# Altium schematic sheet ESP8266V3.SchDoc
size A3; : 汪  先; Organization: Altium Limited; Address1: L3, 12a Rodborough Rd; Address2: Frenchs Forest; Address3: NSW; Address4: Australia 2086; Size: A 4
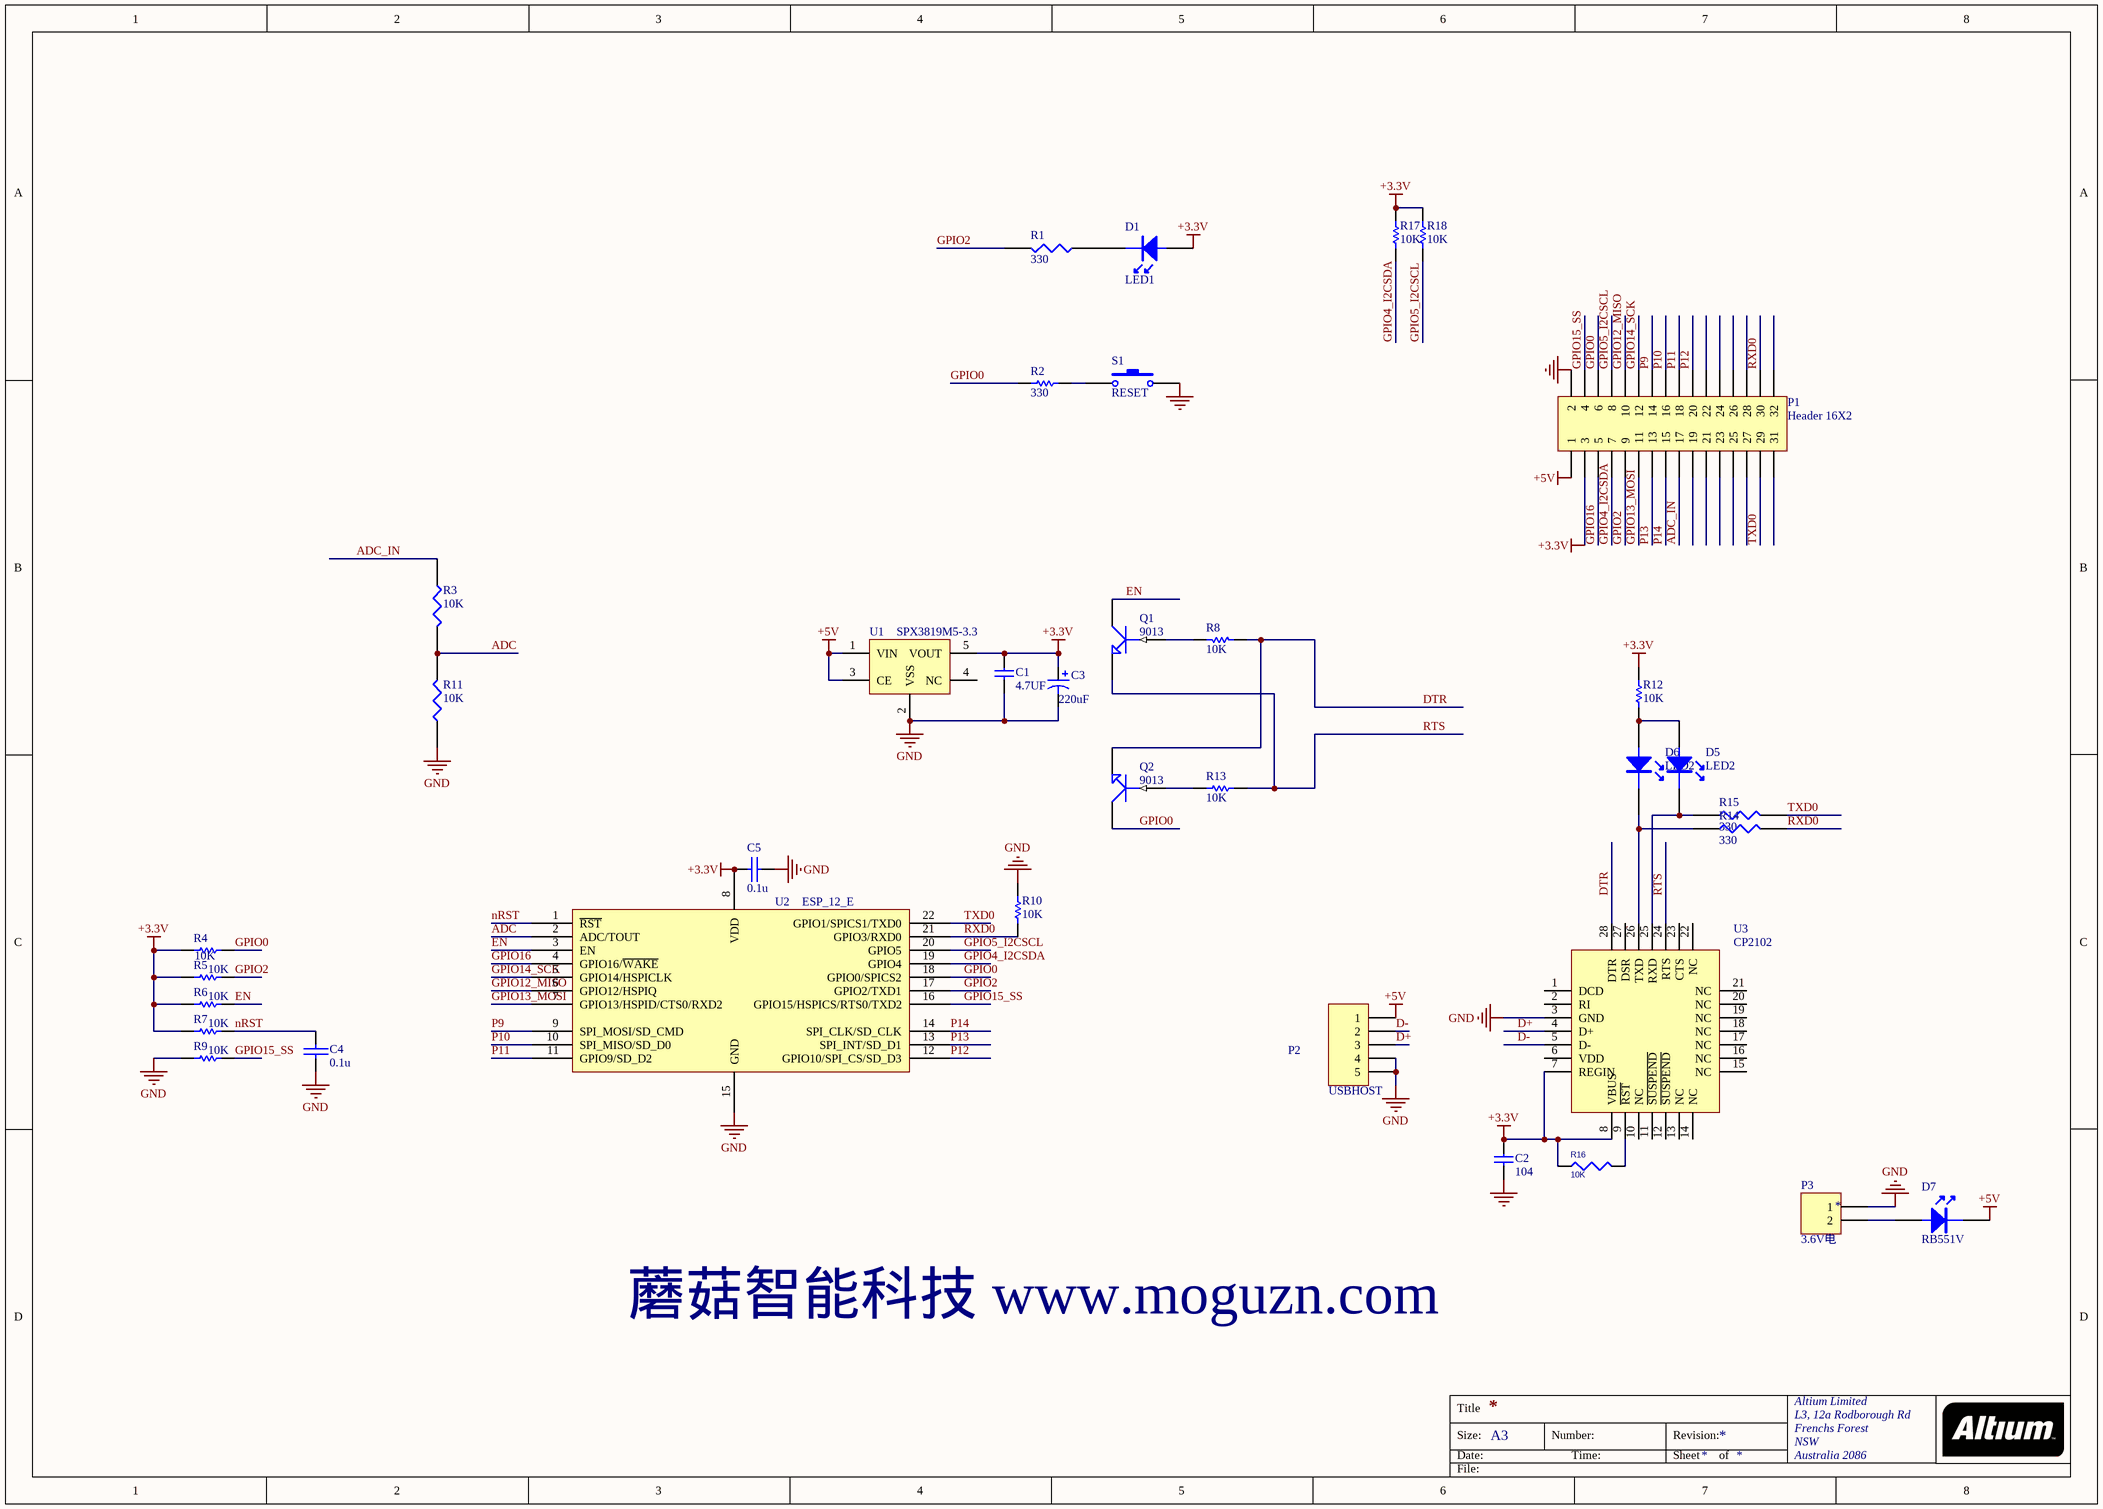
[diagram p0: ESP8266V3.SchDoc]

## Parts
C1  4.7UF  [0805C1]
C2  104  [0603CC]
C3  value 220uF  [CAP-6032]  (hidden comment: Cap Pol1)
C4  0.1u  [0603CC]
C5  0.1u  [0603CC]
D1  LED1  [0805LED]
D5  LED2  [0805LED]
D6  LED2  [0805LED]
D7  RB551V  [0805LED]
P1  Header 16X2  [HEADER 2*5]
P2  USBHOST  [USB_mini]
P3  *  [lithium_connector]
Q1  9013  [SOT-23]
Q2  9013  [SOT-23]
R1  330  [0603RR]
R2  value 330  [0603RR]  (hidden comment: Res1)
R3  10K  [0603RR]
R4  value 10K  [0603RR]  (hidden comment: Res1)
R5  value 10K  [0603RR]  (hidden comment: Res1)
R6  value 10K  [0603RR]  (hidden comment: Res1)
R7  value 10K  [0603RR]  (hidden comment: Res1)
R8  value 10K  [0603RR]  (hidden comment: Res Semi)
R9  value 10K  [0603RR]  (hidden comment: Res1)
R10  value 10K  [0603RR]  (hidden comment: Res1)
R11  10K  [0603RR]
R12  value 10K  [0603RR]  (hidden comment: Res Semi)
R13  value 10K  [0603RR]  (hidden comment: Res1)
R14  330  [0603RR]
R15  330  [0603RR]
R16  10K  [0603RR]
R17  value 10K  [0603RR]  (hidden comment: Res1)
R18  value 10K  [0603RR]  (hidden comment: Res Semi)
S1  RESET  [KEY_6*6*X _SMT]
U1  SPX3819M5-3.3  [SOT23-5]
U2  ESP_12_E  [ESP_12_E]
U3  CP2102  [QFN28]

## Nets
+3.3V: C1.1 C2.1 C3.1 C5.2 D1.1 P1.3 R4.2 R5.2 R6.2 R7.2 R12.1 R16.1 R17.2 R18.2 U1.5(VOUT) U2.8(VDD) U3.7(REGIN) U3.8(VBUS)
+5V: D7.2 P1.1 P2.1 U1.1(VIN) U1.3(CE)
GND: C1.2 C2.2 C3.2 C4.1 C5.1 P1.2 P2.4 P2.5 P3.1 R9.2 R10.1 R11.1 S1.1 U1.2(VSS) U2.15(GND) U3.3(GND)
ADC: R3.2 R11.2 U2.2(ADC/TOUT)
ADC_IN: P1.17 R3.1
D+: P2.3 U3.4(D+)
D-: P2.2 U3.5(D-)
DTR: Q2.2(E) R8.1 U3.28(DTR)
EN: Q1.3(C) R6.1 U2.3(EN)
GPIO0: P1.6 Q2.3(C) R2.1 R4.1 U2.18(GPIO0/SPICS2)
GPIO2: P1.9 R1.2 R5.1 U2.17(GPIO2/TXD1)
GPIO4_I2CSDA: P1.7 R17.1 U2.19(GPIO4)
GPIO5_I2CSCL: P1.8 R18.1 U2.20(GPIO5)
GPIO12_MISO: P1.10 U2.6(GPIO12/HSPIQ)
GPIO13_MOSI: P1.11 U2.7(GPIO13/HSPID/CTS0/RXD2)
GPIO14_SCK: P1.12 U2.5(GPIO14/HSPICLK)
GPIO15_SS: P1.4 R9.1 U2.16(GPIO15/HSPICS/RTS0/TXD2)
GPIO16: P1.5 U2.4(GPIO16/~{WAKE})
nRST: C4.2 R7.1 U2.1(~{RST})
P9: P1.14 U2.9(SPI_MOSI/SD_CMD)
P10: P1.16 U2.10(SPI_MISO/SD_D0)
P11: P1.18 U2.11(GPIO9/SD_D2)
P12: P1.20 U2.12(GPIO10/SPI_CS/SD_D3)
P13: P1.13 U2.13(SPI_INT/SD_D1)
P14: P1.15 U2.14(SPI_CLK/SD_CLK)
RTS: Q1.2(E) R13.1 U3.24(RTS)
RXD0: P1.30 R10.2 R14.2 U2.21(GPIO3/RXD0)
TXD0: P1.29 R15.2 U2.22(GPIO1/SPICS1/TXD0)
NetD1_2: D1.2 R1.1
NetD5_1: D5.1 D6.1 R12.2
NetD5_2: D5.2 R15.1 U3.25(RXD)
NetD6_2: D6.2 R14.1 U3.26(TXD)
NetD7_1: D7.1 P3.2
NetQ1_1: Q1.1(B) R8.2
NetQ2_1: Q2.1(B) R13.2
NetR2_2: R2.2 S1.2
NetR16_2: R16.2 U3.9(~{RST})

Not connected (* = marked no-connect by the designer): P1 19 21 22 23 24 25 26 27 28 31 32; U1 4(NC); U3 1(DCD) 2(RI) 6(VDD) 10(NC) 11(~{SUSPEND}) 12(~{SUSPEND}) 13(NC) 14(NC) 15(NC) 16(NC) 17(NC) 18(NC) 19(NC) 20(NC) 21(NC) 22(NC) 23(CTS) 27(DSR)

## Notes on the sheet
- 蘑菇智能科技 www.moguzn.com
- Title
- Size:
- Date:
- A3
- Number:
- Time:
- Revision:
- Sheet
- of
- File:
- (in symbol Header 2) 3.6V电

## Library data of the parts
C1 C2 = C0402-1.2p: Capacitor, NP0, ?.1pF; Value: 1.2pF; Note: 50V; Artikkelnr Noca: 20029157; Part Number: C0402-1.2p; Manufacturer: *; Manufacturer Part Number: *; Datasheet: *; Footprint: 0402; LatestRevisionDate: 2011-05-11; Pin Count: 2; Publisher: Nordic Semiconductor; Published: 2009-05-08; Supplier: *; Supplier part number: *; 2nd source Supplier: *; 2nd source part number: *
C3 = Cap Pol1: Polarized Capacitor (Radial); Published: 8-Jun-2000; LatestRevisionDate: 17-Jul-2002; LatestRevisionNote: Re-released for DXP Platform.; PackageReference: RB7.6-15; Publisher: Altium Limited; PackageDescription: Polarized Capacitor (Radial); 2 Leads
C4 C5 = CAP: Capacitor
D1 D5-D7 = LED
P1 = Header 16X2: Header, 16-Pin, Dual row; LatestRevisionDate: 17-Jul-2002; LatestRevisionNote: Re-released for DXP Platform.; Publisher: Altium Limited
P2 = Header 5: Header, 5-Pin; LatestRevisionDate: 17-Jul-2002; LatestRevisionNote: Re-released for DXP Platform.; Publisher: Altium Limited
P3 = Header 2: Header, 2-Pin; LatestRevisionDate: 17-Jul-2002; LatestRevisionNote: Re-released for DXP Platform.; Publisher: Altium Limited
Q1 Q2 = NPN1: NPN Transistor
R1 R3 R11 R14 R15 = RES1
R2 R4-R7 R9 R10 R13 R17 = Res1: Resistor; Published: 8-Jun-2000; LatestRevisionDate: 17-Jul-2002; LatestRevisionNote: Re-released for DXP Platform.; PackageReference: AXIAL-0.3; Publisher: Altium Limited; PackageDescription: Axial Device, Thru-Hole; 2 Leads; 0.3 in Pin Spacing
R8 R12 R18 = Res Semi: Semiconductor Resistor; Published: 8-Jun-2000; LatestRevisionDate: 17-Jul-2002; LatestRevisionNote: Re-released for DXP Platform.; PackageReference: AXIAL-0.5; Publisher: Altium Limited; PackageDescription: Axial Device, Thru-Hole; 2 Leads; 0.5 in Pin Spacing
R16 = R_0402: Right: *; Bottom: *; Vendor: *
S1 = SW-PB: Switch; Published: 24-Mar-1999; LatestRevisionDate: 17-Jul-2002; LatestRevisionNote: Re-released for DXP Platform.; PackageReference: SPST-2; Publisher: Altium Limited; PackageDescription: Switch; 2 Leads
U1 = XC6215
U2 = ESP_12_E: ESP-12 Wi-Fi Module by AI-Thinker; IC: ESP8266-EX; Vendor: Ai-thinker